# EAGLE design main (EAGLE 8.7.0)
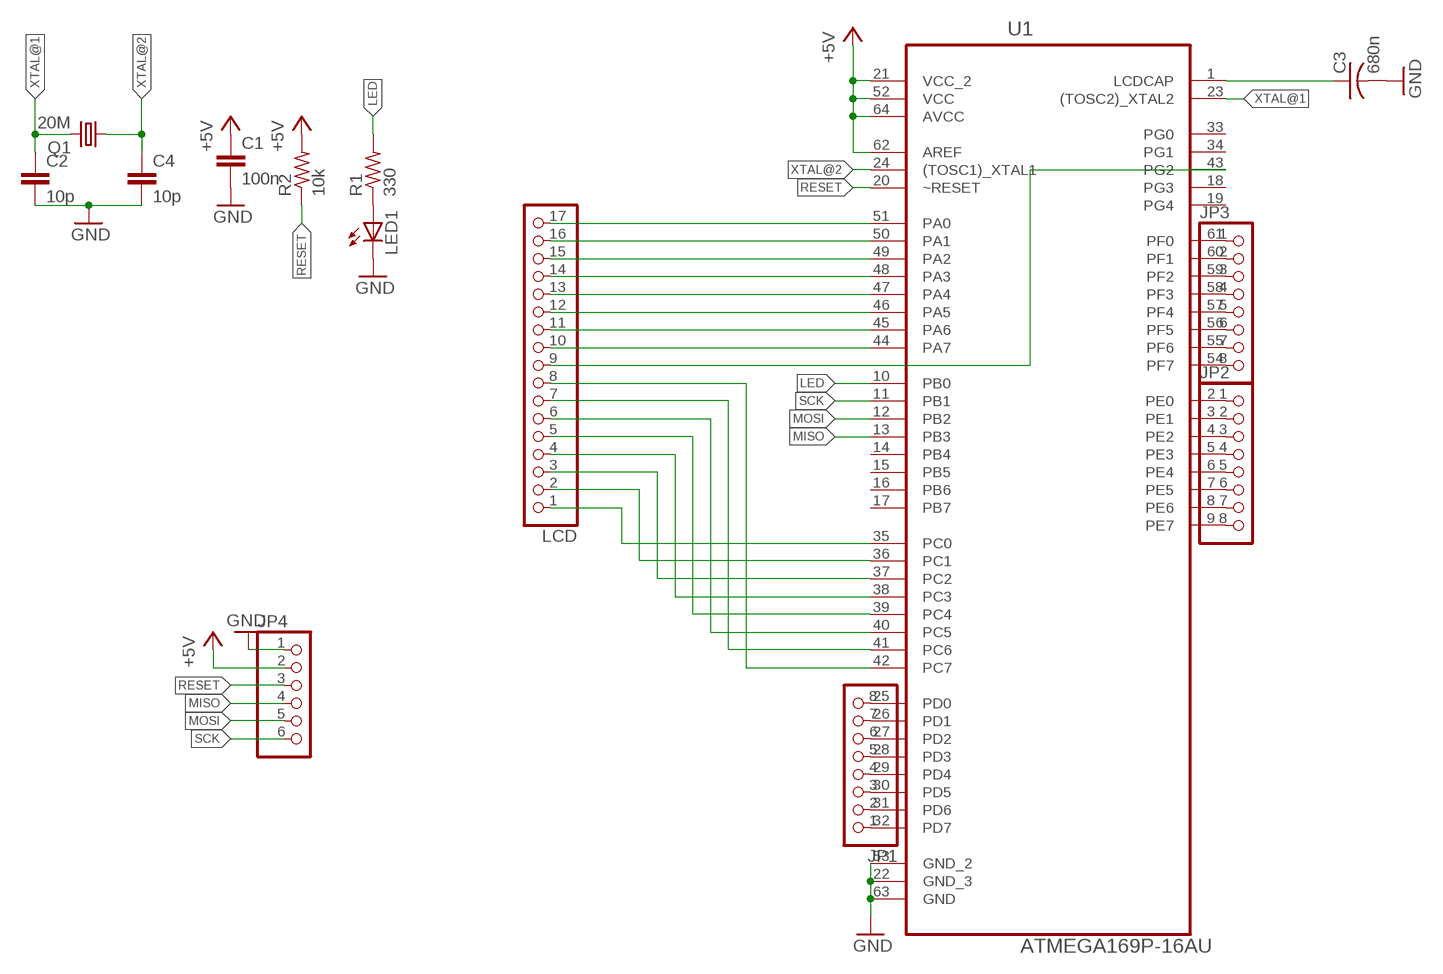
[diagram p0: schematic, sheet 1]

## Parts
C1  100n  C-EUC0603  [C0603]
C2  10p  C-EUC0603  [C0603]
C3  680n  C-US025-025X050  [C025-025X050]
C4  10p  C-EUC0603  [C0603]
JP1  PINHD-1X8/90  [1X08/90]
JP2  PINHD-1X8/90  [1X08/90]
JP3  PINHD-1X8/90  [1X08/90]
JP4  PINHD-1X6  [1X06]
LCD  PINHD-1X17  [1X17]
LED1  LEDCHIPLED_0805  [CHIPLED_0805]
Q1  20M  CRYSTALHC49UP  [HC49UP]
R1  330  R-US_R0603  [R0603]
R2  10k  R-US_R0603  [R0603]
U1  ATMEGA169P-16AU  [QFP80P1600X1600X120-64N]

## Nets
+5V: C1.1 JP4.2 R2.2 U1.21(VCC_2) U1.52(VCC) U1.62(AREF) U1.64(AVCC)
GND: C1.2 C2.2 C3.2 C4.2 JP4.1 LED1.C U1.22(GND_3) U1.53(GND_2) U1.63(GND)
LED: R1.2 U1.10(PB0)
MISO: JP4.4 U1.13(PB3)
MOSI: JP4.5 U1.12(PB2)
N$1: LED1.A R1.1
N$2: LCD.9 U1.43(PG2)
N$3: LCD.8 U1.42(PC7)
N$4: C3.1 U1.1(LCDCAP)
N$5: LCD.7 U1.41(PC6)
N$6: LCD.6 U1.40(PC5)
N$7: LCD.5 U1.39(PC4)
N$8: LCD.10 U1.44(PA7)
N$9: LCD.11 U1.45(PA6)
N$10: LCD.12 U1.46(PA5)
N$11: LCD.13 U1.47(PA4)
N$12: LCD.14 U1.48(PA3)
N$13: LCD.15 U1.49(PA2)
N$14: LCD.16 U1.50(PA1)
N$15: LCD.17 U1.51(PA0)
N$16: LCD.4 U1.38(PC3)
N$17: LCD.3 U1.37(PC2)
N$18: LCD.2 U1.36(PC1)
N$19: LCD.1 U1.35(PC0)
N$20: JP1.1 U1.32(PD7)
N$21: JP1.2 U1.31(PD6)
N$22: JP1.3 U1.30(PD5)
N$23: JP1.4 U1.29(PD4)
N$24: JP1.5 U1.28(PD3)
N$25: JP1.6 U1.27(PD2)
N$26: JP1.7 U1.26(PD1)
N$27: JP1.8 U1.25(PD0)
N$28: JP2.1 U1.2(PE0)
N$29: JP2.2 U1.3(PE1)
N$30: JP2.3 U1.4(PE2)
N$31: JP2.4 U1.5(PE3)
N$32: JP2.5 U1.6(PE4)
N$33: JP2.6 U1.7(PE5)
N$34: JP2.7 U1.8(PE6)
N$35: JP2.8 U1.9(PE7)
N$36: JP3.1 U1.61(PF0)
N$37: JP3.2 U1.60(PF1)
N$38: JP3.3 U1.59(PF2)
N$39: JP3.4 U1.58(PF3)
N$40: JP3.5 U1.57(PF4)
N$41: JP3.6 U1.56(PF5)
N$42: JP3.7 U1.55(PF6)
N$43: JP3.8 U1.54(PF7)
RESET: JP4.3 R2.1 U1.20(~RESET)
SCK: JP4.6 U1.11(PB1)
XTAL@1: C2.1 Q1.2 U1.23((TOSC2)_XTAL2)
XTAL@2: C4.1 Q1.1 U1.24((TOSC1)_XTAL1)
Unconnected: U1.14(PB4) U1.15(PB5) U1.16(PB6) U1.17(PB7) U1.18(PG3) U1.19(PG4) U1.33(PG0) U1.34(PG1)

## Library data of the parts
C1 C2 C4 = rcl:C-EU: CAPACITOR, European symbol; SPICEPREFIX: C
C3 = rcl:C-US: CAPACITOR, American symbol; SPICEPREFIX: C
JP1-JP3 = pinhead:PINHD-1X8: PIN HEADER
JP4 = pinhead:PINHD-1X6: PIN HEADER
LCD = pinhead:PINHD-1X17: PIN HEADER
LED1 = led:LED: LED OSRAM: - CHIPLED LG R971, LG N971, LY N971, LG Q971, LY Q971, LO R971, LY R971 LH N974, LH R974 LS Q976, LO Q976, LY Q976 LO Q996 - Hyper CHIPLED LW Q18S LB Q993, LB Q99A, LB R99A - SideLED LS A670, LO A670, LY A670, LG A670, LP A670 LB A673, LV A673, LT A673, LW A673 LH A674 LY A675 LS A676, LA A676, LO A676, LY A676, LW A676 LS A679, LY A679, LG A679 - Hyper Micro SIDELED® LS Y876, LA Y876, LO Y876, LY Y876 LT Y87S - SmartLED LW L88C, LW L88S LB L89C, LB L89S, LG L890 LS L89K, LO L89K, LY L89K LS L896, LA L896, LO L896, LY L896 - TOPLED LS T670, LO T670, LY T670, LG T670, LP T670 LSG T670, LSP T670, LSY T670, LOP T670, LYG T670 LG T671, LOG T671, LSG T671 LB T673, LV T673, LT T673, LW T673 LH T674 LS T676, LA T676, LO T676, LY T676, LB T676, LH T676, LSB T676, LW T676 LB T67C, LV T67C, LT T67C, LS T67K, LO T67K, LY T67K, LW E67C LS E67B, LA E67B, LO E67B, LY E67B, LB E67C, LV E67C, LT E67C LW T67C LS T679, LY T679, LG T679 LS T770, LO T770, LY T770, LG T770, LP T770 LB T773, LV T773, LT T773, LW T773 LH T774 LS E675, LA E675, LY E675, LS T675 LS T776, LA T776, LO T776, LY T776, LB T776 LHGB T686 LT T68C, LB T68C - Hyper Mini TOPLED® LB M676 - Mini TOPLED Santana® LG M470 LS M47K, LO M47K, LY M47K Source: http://www.osram.convergy.de LUXEON: - LUMILED® LXK2-PW12-R00, LXK2-PW12-S00, LXK2-PW14-U00, LXK2-PW14-V00 LXK2-PM12-R00, LXK2-PM12-S00, LXK2-PM14-U00 LXK2-PE12-Q00, LXK2-PE12-R00, LXK2-PE12-S00, LXK2-PE14-T00, LXK2-PE14-U00 LXK2-PB12-K00, LXK2-PB12-L00, LXK2-PB12-M00, LXK2-PB14-N00, LXK2-PB14-P00, LXK2-PB14-Q00 LXK2-PR12-L00, LXK2-PR12-M00, LXK2-PR14-Q00, LXK2-PR14-R00 LXK2-PD12-Q00, LXK2-PD12-R00, LXK2-PD12-S00 LXK2-PH12-R00, LXK2-PH12-S00 LXK2-PL12-P00, LXK2-PL12-Q00, LXK2-PL12-R00 Source: www.luxeon.com KINGBRIGHT: KA-3528ASYC Source: www.kingbright.com
Q1 = crystal:CRYSTAL: CRYSTAL; OC_FARNELL: unknown; OC_NEWARK: unknown
R1 R2 = rcl:R-US_: RESISTOR, American symbol; SPICEPREFIX: R
U1 = Atmel_By_element14_Batch_1-00:ATMEGA169P-16AU: 8-bit Microcontroller with 16K Bytes In-System Programmable Flash; MPN: ATMEGA169P-16AU; OC_FARNELL: 1675975; OC_NEWARK: 33P6478; PACKAGE: TQFP-64; SUPPLIER: Atmel

## Board
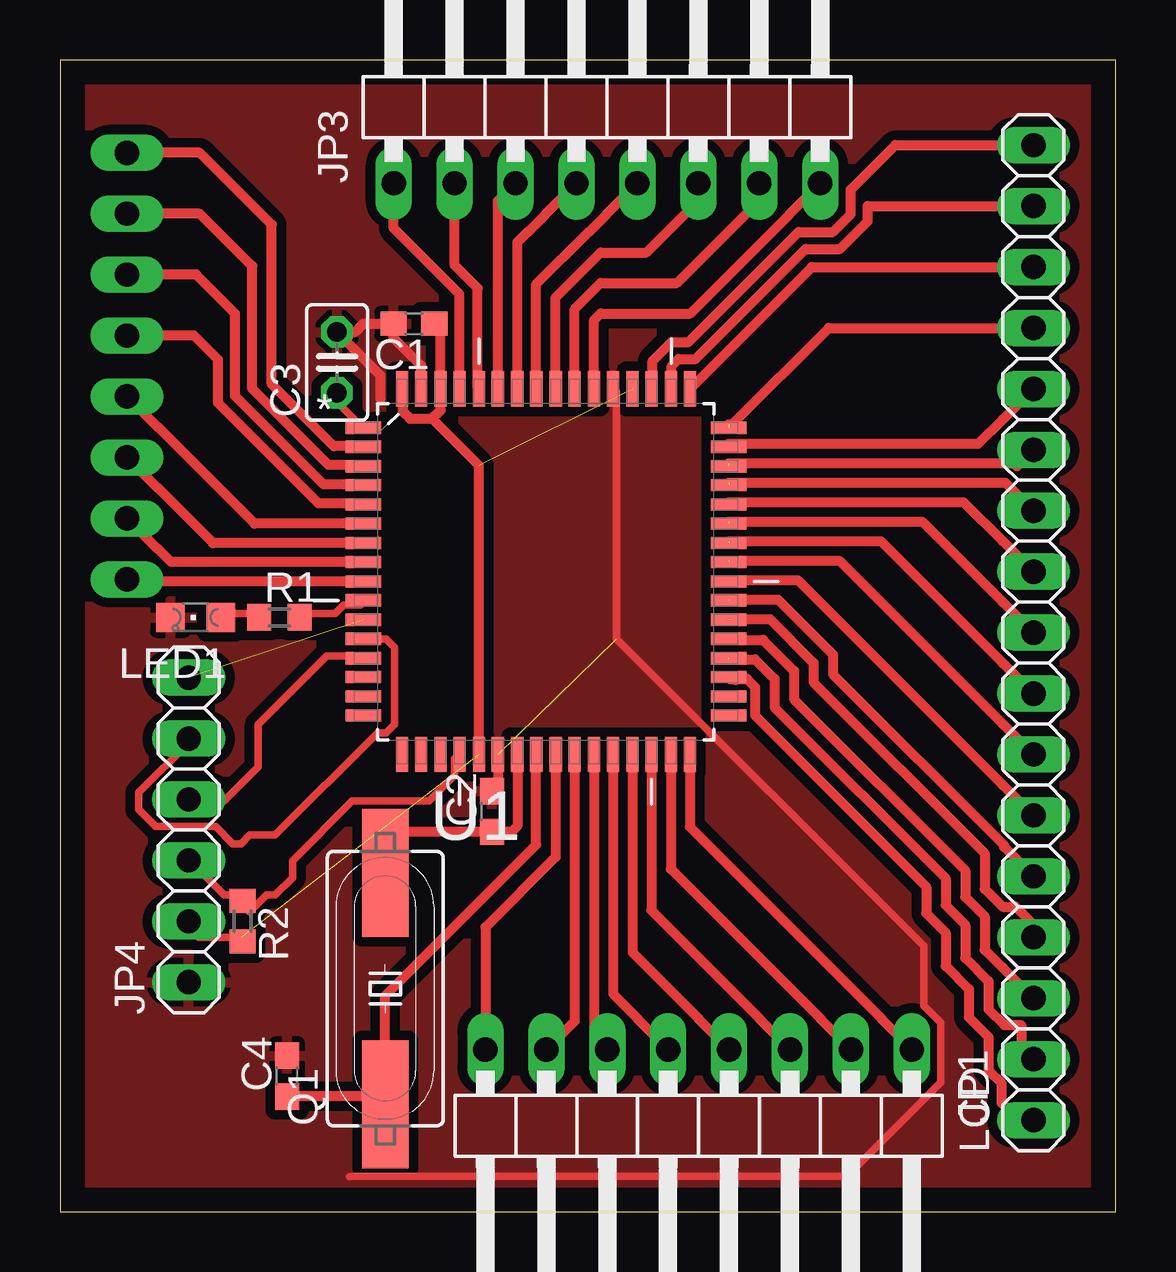
[diagram p1: board, top side]
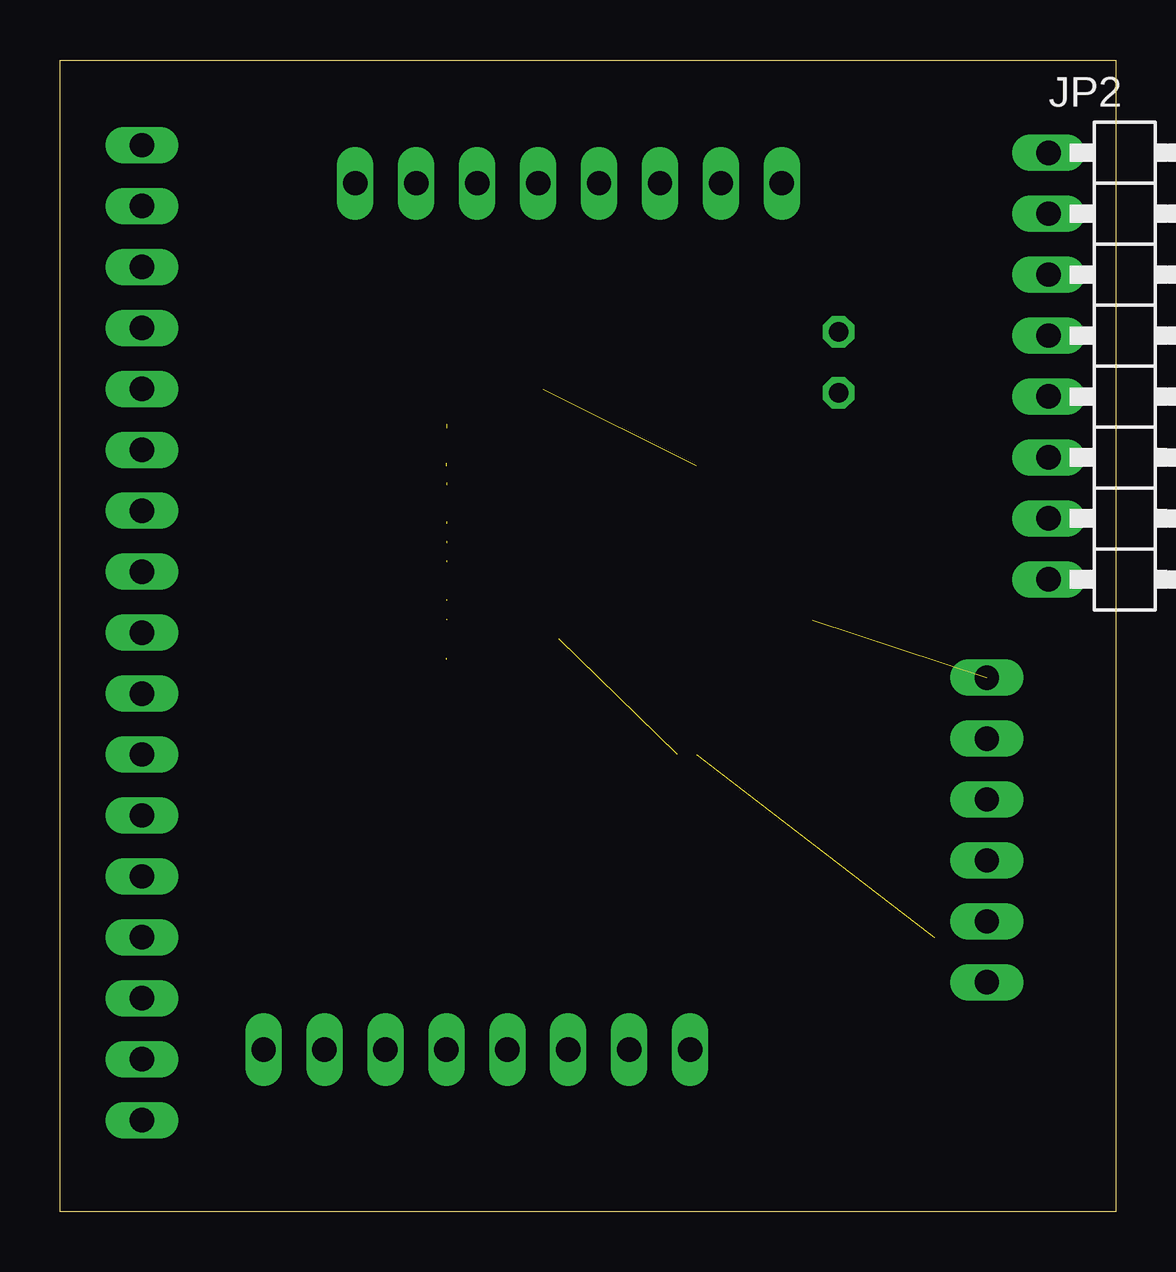
[diagram p2: board, bottom side, seen from below]

Size 44 x 48 mm. Coordinates in mm from the lower left corner, seen from the top.
Outline: 0,0 44,0 44,48 0,48 0,0
Copper layers (1*16): Top 0.035mm / dielectric 1.5mm / Bottom 0.035mm
Design rules "default *": minimum track width 12mil, minimum drill 0.8mm, track to track 16mil, track to pad 6mil, pad to pad 6mil, via to via 12mil, smd to smd 6mil, copper to edge 40mil, drill to drill 12mil, minimum pad ring 10mil, minimum via ring 8mil, stop-mask expansion 4mil, vias tented up to drill 0mil, thermal gap 10mil

### Footprints (pad centres in the part's own frame; a part is rotated, then mirrored left to right if it is on the bottom)
C0603 = smd 1.1 x 1: 1 -0.85,0; 2 0.85,0
C025-025X050 = drill 0.813 octagon: 1 -1.27,0; 2 1.27,0
1X08/90 = drill 1.016 long: 1 -8.89,-3.81; 2 -6.35,-3.81; 3 -3.81,-3.81; 4 -1.27,-3.81; 5 1.27,-3.81; 6 3.81,-3.81; 7 6.35,-3.81; 8 8.89,-3.81
1X06 = drill 1.016 long: 1 -6.35,0; 2 -3.81,0; 3 -1.27,0; 4 1.27,0; 5 3.81,0; 6 6.35,0
1X17 = drill 1.016 long: 1 -20.32,0; 2 -17.78,0; 3 -15.24,0; 4 -12.7,0; 5 -10.16,0; 6 -7.62,0; 7 -5.08,0; 8 -2.54,0; 9 0,0; 10 2.54,0; 11 5.08,0; 12 7.62,0; 13 10.16,0; 14 12.7,0; 15 15.24,0; 16 17.78,0; 17 20.32,0
CHIPLED_0805 = smd 1.2 x 1.2: A 0,-1.05; C 0,1.05
HC49UP = smd 5.334 x 1.93: 1 -4.826,0; 2 4.826,0
R0603 = smd 1 x 1.1: 1 -0.85,0; 2 0.85,0
QFP80P1600X1600X120-64N = smd 1.473 x 0.508: 1 -7.62,5.994; 2 -7.62,5.207; 3 -7.62,4.394; 4 -7.62,3.607; 5 -7.62,2.794; 6 -7.62,2.007; 7 -7.62,1.194; 8 -7.62,0.406; 9 -7.62,-0.406; 10 -7.62,-1.194; 11 -7.62,-2.007; 12 -7.62,-2.794; 13 -7.62,-3.607; 14 -7.62,-4.394; 15 -7.62,-5.207; 16 -7.62,-5.994; 33 7.62,-5.994; 34 7.62,-5.207; 35 7.62,-4.394; 36 7.62,-3.607; 37 7.62,-2.794; 38 7.62,-2.007; 39 7.62,-1.194; 40 7.62,-0.406; 41 7.62,0.406; 42 7.62,1.194; 43 7.62,2.007; 44 7.62,2.794; 45 7.62,3.607; 46 7.62,4.394; 47 7.62,5.207; 48 7.62,5.994 | smd 0.508 x 1.473: 17 -5.994,-7.62; 18 -5.207,-7.62; 19 -4.394,-7.62; 20 -3.607,-7.62; 21 -2.794,-7.62; 22 -2.007,-7.62; 23 -1.194,-7.62; 24 -0.406,-7.62; 25 0.406,-7.62; 26 1.194,-7.62; 27 2.007,-7.62; 28 2.794,-7.62; 29 3.607,-7.62; 30 4.394,-7.62; 31 5.207,-7.62; 32 5.994,-7.62; 49 5.994,7.62; 50 5.207,7.62; 51 4.394,7.62; 52 3.607,7.62; 53 2.794,7.62; 54 2.007,7.62; 55 1.194,7.62; 56 0.406,7.62; 57 -0.406,7.62; 58 -1.194,7.62; 59 -2.007,7.62; 60 -2.794,7.62; 61 -3.607,7.62; 62 -4.394,7.62; 63 -5.207,7.62; 64 -5.994,7.62

### Placement (x,y rotation side)
C1  14.76,37 180 top
C2  18,16.67 90 top
C3  11.55,35.39 90 top
C4  9.46,5.65 90 top
JP1  26.62,2.95 180 top
JP2  -1.01,35.24 270 bottom
JP3  22.8,46.67 0 top
JP4  5.37,15.9 90 top
LCD  40.58,24.13 90 top
LED1  5.65,24.77 90 top
Q1  13.56,9.29 90 top
R1  9.15,24.77 0 top
R2  7.61,12.1 270 top
U1  20.26,26.67 0 top

### Tracks (layer width: path | path; a pad name or v marks a point on that pad's centre or on a via)
+5V  (2 unrouted)
  Top 0.305: R2.2 7.55,11.42 5.78,11.42 5.42,11.78 JP4.2
  Top 0.406: C1.1 15.87,36.75 U1.62 15.87,33.39 15.52,33.05 | U1.64 14.29,34.27 14.29,33.34 14.59,33.05 15.52,33.05 | U1.21 17.47,31.1 15.52,33.05
GND  (1 unrouted)
  Top 0.305: U1.53 23.2,34.18 23.2,23.87 36,11.06 36,8.58 36.71,7.86 36.71,5.38 32.8,1.46 12.18,1.46 12.08,1.45
  Top 0.406: U1.22 18.25,17.77 C2.2 | U1.63 15.05,35.27 13.91,36.41 C1.2 12.63,37 12.29,36.66 C3.2 13.34,34.87 13.34,33.87
  pour Top (isolate 0.406): -0.32,48.23 44.13,48.23 44.13,-0.04 -0.32,-0.04
LED
  Top 0.305: R1.2 10.04,24.93 11.47,24.93 11.82,25.29 12.53,25.29 U1.10
MISO
  Top 0.305: U1.13 12.53,23.16 11.11,23.16 8.27,20.31 8.27,18.53 6.84,17.11 5.42,17.11 JP4.4
MOSI
  Top 0.305: U1.12 12.89,23.87 13.6,23.87 13.96,23.51 13.96,20.31 13.6,19.95 13.24,19.95 8.98,15.69 7.91,15.69 7.55,15.33 7.2,15.33 6.49,16.04 4,16.04 3.29,16.75 3.29,17.47 5.42,19.6 JP4.5
N$1
  Top 0.305: R1.1 8.27,24.93 6.84,24.93 LED1.A
N$2  (1 unrouted)
  Top 0.406: LCD.9 39.31,25.4 39.29,25.4 35.94,28.75 27.88,28.75
N$3  (1 unrouted)
  Top 0.406: LCD.8 39.31,22.86 39.29,22.86 34.21,27.94 27.88,27.94
N$4
  Top 0.305: U1.1 12.53,32.76 11.47,33.82 C3.1
N$5  (1 unrouted)
  Top 0.406: LCD.7 39.31,20.32 39.29,20.32 32.48,27.13 27.88,27.13
N$6
  Top 0.305: U1.40 28.18,26.36 28.18,26.31
  Top 0.406: LCD.6 39.31,17.78 39.29,17.78 30.76,26.31 28.18,26.31 27.88,26.31
N$7  (1 unrouted)
  Top 0.406: LCD.5 39.36,15.19 39.36,15.25 32.22,22.39 32.22,23.21 29.93,25.5 27.88,25.5
N$8
  Top 0.305: U1.44 28.18,29.56 28.18,29.57
  Top 0.406: LCD.10 39.31,27.94 39.29,27.94 37.67,29.57 28.18,29.57 27.88,29.57
N$9  (1 unrouted)
  Top 0.406: 27.88,30.38 39.41,30.38 LCD.11
N$10  (1 unrouted)
  Top 0.406: LCD.12 39.89,31.06 39.88,31.06 39.75,31.19 27.88,31.19
N$11
  Top 0.305: U1.47 28.18,32.05 28.18,32
  Top 0.406: LCD.13 39.31,33.02 39.29,33.02 38.28,32 28.18,32 27.88,32
N$12  (1 unrouted)
  Top 0.406: LCD.14 32.05,36.83 28.03,32.82 27.88,32.82
N$13
  Top 0.406: U1.49 31.33,39.37 LCD.15
N$14
  Top 0.406: U1.50 25.49,34.31 25.49,35.24 25.79,35.53 26.49,35.53 31.08,40.12 32.51,40.12 33.67,41.28 33.67,41.91 LCD.16
N$15
  Top 0.406: LCD.17 34.81,44.45 32.96,42.6 32.96,41.57 32.22,40.83 30.78,40.83 26.2,36.25 25.5,36.25 24.7,35.45 24.7,34.34 U1.51
N$16  (1 unrouted)
  Top 0.406: LCD.4 40.58,11.96 39.84,12.7 39.29,12.7 38.55,13.44 38.55,14.92 31.41,22.05 31.41,22.87 29.6,24.69 27.88,24.69
N$17
  Top 0.406: U1.37 27.93,23.82 29.31,23.82 30.6,22.54 30.6,21.35 37.73,14.21 37.73,13.11 38.55,12.29 38.55,10.9 39.29,10.16 39.31,10.16 LCD.3
N$18  (1 unrouted)
  Top 0.406: LCD.2 40.07,6.86 40.07,7.77 39.36,7.77 38.7,8.43 38.7,9.6 37.73,10.57 37.73,11.96 36.92,12.77 36.92,13.88 29.79,21.02 29.79,22.2 28.97,23.01 27.88,23.01
N$19
  Top 0.305: U1.35 28.18,22.09 28.18,22.2
  Top 0.406: 27.88,22.2 28.18,22.2 28.64,22.2 28.97,21.86 28.97,20.68 36.11,13.54 36.11,12.43 36.92,11.62 36.92,10.23 37.89,9.27 37.89,8.09 38.7,7.28 38.7,5.89 39.25,5.33 39.25,4.51 39.95,3.81 LCD.1
N$20
  Top 0.406: JP1.1 34.24,8.03 34.24,8.04 26.25,16.03 U1.32
N$21
  Top 0.406: JP1.2 31.7,8.03 31.7,8.04 25.47,14.28 U1.31
N$22
  Top 0.406: JP1.3 29.16,8.03 29.16,8.04 24.65,12.55 U1.30
N$23
  Top 0.406: JP1.4 26.62,8.03 26.62,8.04 23.87,10.8 U1.29
N$24
  Top 0.406: JP1.5 24.08,8.03 24.08,8.04 23.05,9.07 U1.28
N$25
  Top 0.406: U1.27 22.27,7.3 JP1.6
N$26
  Top 0.406: U1.26 21.45,7.94 JP1.7
N$27
  Top 0.406: U1.25 20.67,14.78 17.73,11.85 JP1.8
N$28
  Top 0.406: U1.2 12.62,31.9 11.41,31.9 8.82,34.48 8.82,41.14 5.83,44.13 JP2.1
N$29
  Top 0.406: U1.3 12.59,31.12 11.19,31.12 8.01,34.29 8.01,39.41 5.83,41.59 JP2.2
N$30
  Top 0.406: U1.4 12.62,30.3 10.99,30.3 7.3,34 7.3,37.43 5.68,39.05 JP2.3
N$31
  Top 0.406: JP2.4 5.59,36.51 6.59,35.52 6.59,33.7 10.78,29.52 12.59,29.52 U1.5
N$32
  Top 0.406: JP2.5 4.07,32.7 4.09,32.7 8.11,28.68 U1.6
N$33
  Top 0.406: JP2.6 4.07,30.16 4.09,30.16 6.38,27.86 U1.7
N$34
  Top 0.406: U1.8 4.63,27.08 4.09,27.62 4.07,27.62 JP2.7
N$35
  Top 0.406: U1.9 2.89,26.26 JP2.8
N$36
  Top 0.406: U1.61 16.65,38.24 13.91,40.98 JP3.1
N$37
  Top 0.406: U1.60 17.41,34.34 17.41,38.48 16.45,39.45 JP3.2
N$38
  Top 0.406: U1.59 18.25,42.13 JP3.3
N$39
  Top 0.406: U1.58 19.07,40.4 19.5,40.83 19.52,40.83 20.26,41.57 20.26,41.59 JP3.4
N$40
  Top 0.406: U1.57 19.85,38.65 22.04,40.83 22.06,40.83 22.8,41.57 22.8,41.59 JP3.5
N$41
  Top 0.406: U1.56 20.67,38.1 22.54,39.97 24.45,39.97 26.61,42.14 JP3.6
N$42
  Top 0.406: U1.55 21.45,37.61 22.54,38.7 25.71,38.7 29.15,42.14 JP3.7
N$43
  Top 0.406: U1.54 22.27,37.16 22.54,37.43 26.28,37.43 30.42,41.57 30.42,41.59 JP3.8
RESET
  Top 0.305: JP4.3 5.42,14.62 6.84,13.2 7.55,13.2 R2.1 7.55,12.84 7.91,12.49 8.62,13.2 8.98,13.2 9.69,13.91 9.69,14.62 12.18,17.11 15.38,17.11 16.44,18.18 16.44,18.89 U1.20
SCK  (1 unrouted)
XTAL@1
  Top 0.406: U1.23 19.07,16.07 18.81,15.82 C2.1 14.24,15.82 13.56,15.14 Q1.2
XTAL@2
  Top 0.406: U1.24 19.85,15.29 13.56,8.99 Q1.1 13.23,4.8 C4.1